# Altium schematic sheet PythonOrC_HAB__CosmicRayHAB__TXB0104DR.schdoc
size 54 x 42 mm
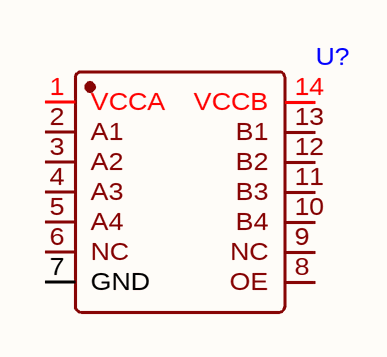
[diagram p0: PythonOrC_HAB__CosmicRayHAB__TXB0104DR.schdoc]

## Parts
U?  (no value)  [SOIC-14_L8.7-W3.9-P1.27-LS6.0-BL]

## Nets

Not connected (* = marked no-connect by the designer): U? 1(VCCA) 2(A1) 3(A2) 4(A3) 5(A4) 6(NC) 7(GND) 8(OE) 9(NC) 10(B4) 11(B3) 12(B2) 13(B1) 14(VCCB)

## Library data of the parts
U? = TXB0104DR